# EAGLE design TempHumiditySensorRaspberryPi (EAGLE 8.5.0)
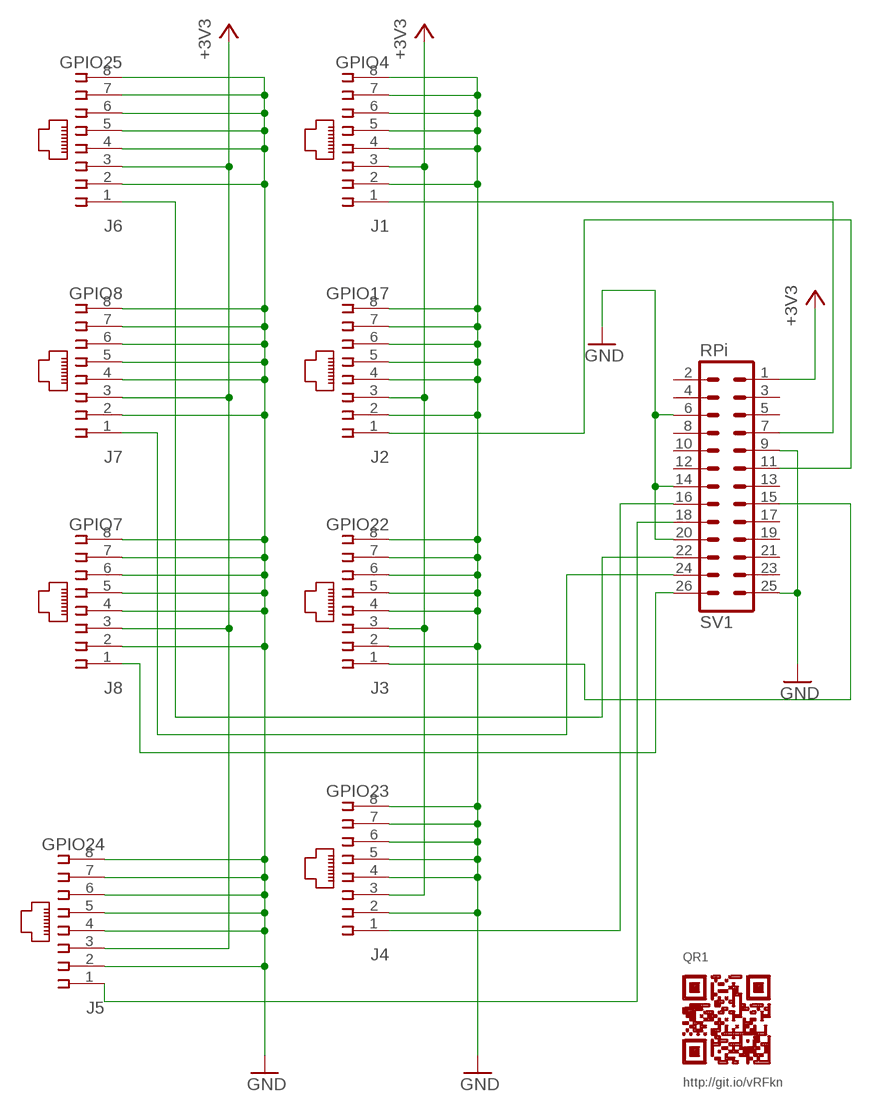
[diagram p0: schematic, sheet 1]

## Parts
J1  GPIO4  555164-1  [555164-1]
J2  GPIO17  555164-1  [555164-1]
J3  GPIO22  555164-1  [555164-1]
J4  GPIO23  555164-1  [555164-1]
J5  GPIO24  555164-1  [555164-1]
J6  GPIO25  555164-1  [555164-1]
J7  GPIO8  555164-1  [555164-1]
J8  GPIO7  555164-1  [555164-1]
QR1  QR-HTTP://GIT.IO/VRFKN  [QR-HTTP://GIT.IO/VRFKN]
SV1  RPi  ML26  [ML26]

## Nets
+3V3 [power]: J1.3 J2.3 J3.3 J4.3 J5.3 J6.3 J7.3 J8.3 SV1.1
GND: J1.2 J1.4 J1.5 J1.6 J1.7 J1.8 J2.2 J2.4 J2.5 J2.6 J2.7 J2.8 J3.2 J3.4 J3.5 J3.6 J3.7 J3.8 J4.2 J4.4 J4.5 J4.6 J4.7 J4.8 J5.2 J5.4 J5.5 J5.6 J5.7 J5.8 J6.2 J6.4 J6.5 J6.6 J6.7 J6.8 J7.2 J7.4 J7.5 J7.6 J7.7 J7.8 J8.2 J8.4 J8.5 J8.6 J8.7 J8.8 SV1.6 SV1.9 SV1.14 SV1.20 SV1.25
N$1: J1.1 SV1.7
N$3: J8.1 SV1.26
N$4: J2.1 SV1.11
N$5: J3.1 SV1.15
N$7: J4.1 SV1.16
N$8: J6.1 SV1.22
N$9: J7.1 SV1.24
N$10: J5.1 SV1.18
Unconnected: SV1.2 SV1.3 SV1.4 SV1.5 SV1.8 SV1.10 SV1.12 SV1.13 SV1.17 SV1.19 SV1.21 SV1.23

## Library data of the parts
J1-J8 = con-amp:555164-1: AMP connector; PARTNO: 5555164-1
QR1 = QR-git.io-vRFkn:QR-HTTP://GIT.IO/VRFKN: QR Code pointing to http://git.io/vRFkn; QR_DEST: http://git.io/vRFkn
SV1 = con-harting-ml:ML26: HARTING; OC_FARNELL: unknown; OC_NEWARK: unknown; PARTNO: SBH11-PBPC-D13-ST-BK

## Net classes
0 default: width 0.508 mm
1 power: width 1.27 mm

## Board
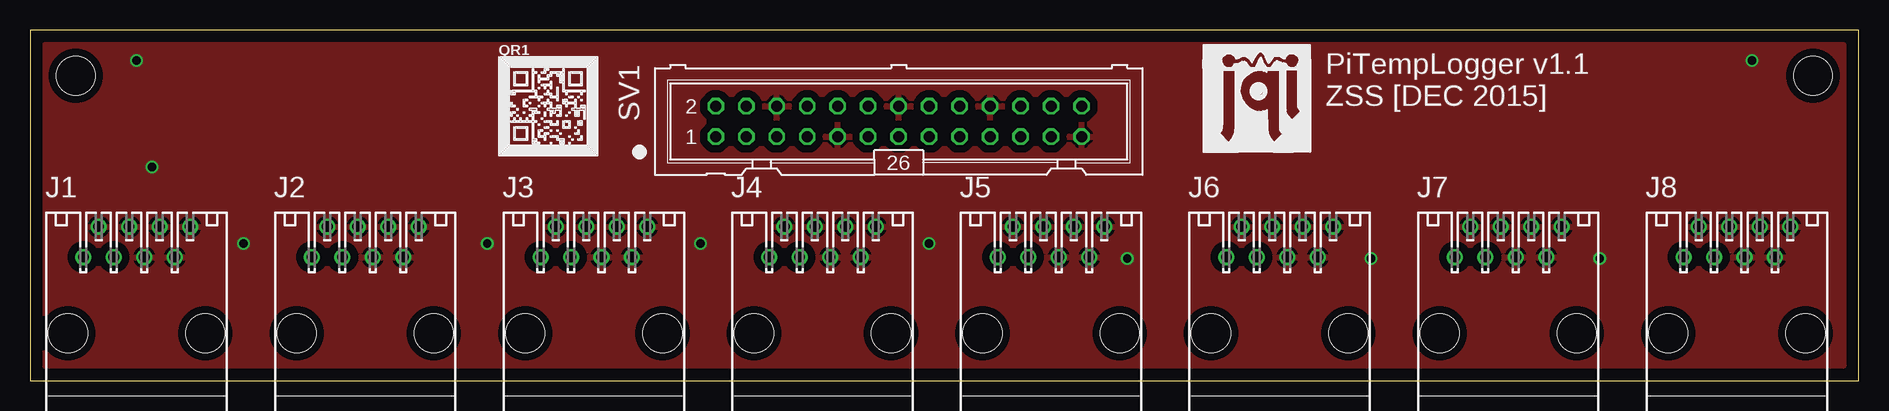
[diagram p1: board, top side]
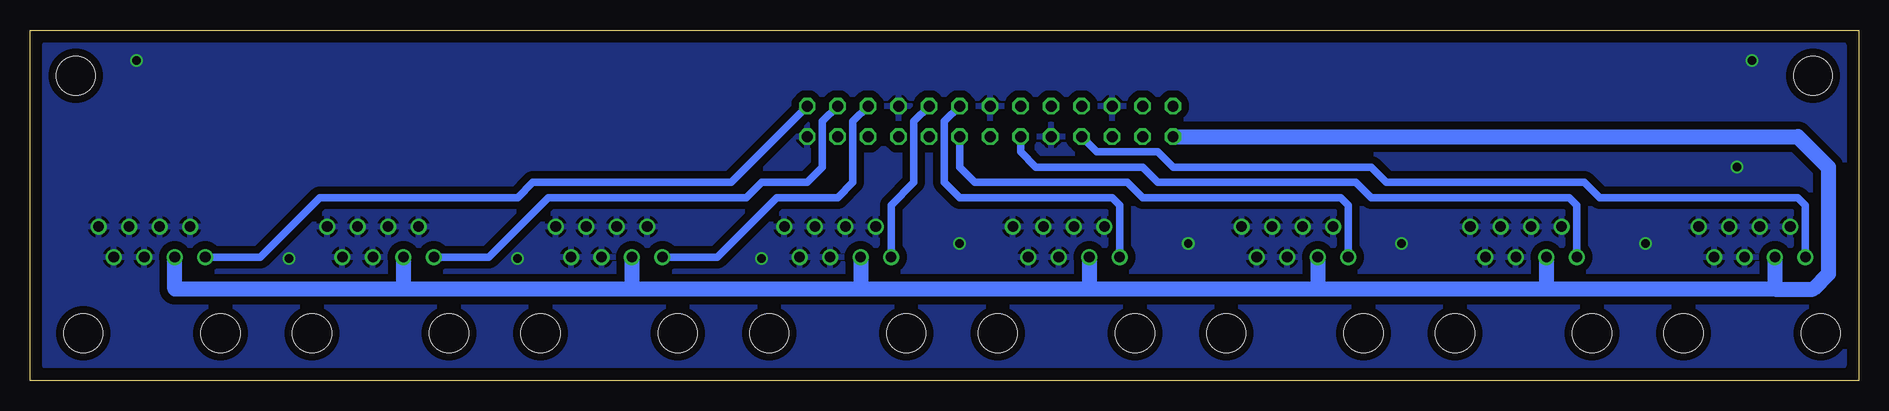
[diagram p2: board, bottom side, seen from below]

Size 152.4 x 29.21 mm. Coordinates in mm from the lower left corner, seen from the top.
Outline: 0,0 152.4,0 152.4,29.21 0,29.21 0,0
Copper layers (1*16): Top 0.035mm / dielectric 1.5mm / Bottom 0.035mm
Design rules "MF_Standard_2_Layer": minimum track width 5mil, minimum drill 12mil, track to track 5mil, track to pad 5mil, pad to pad 5mil, via to via 5mil, smd to smd 0mil, copper to edge 10mil, drill to drill 10mil, minimum pad ring 6mil, minimum via ring 6mil, stop-mask expansion 2mil, vias tented up to drill 25mil, thermal gap 10mil
Holes 3.2 mm at 148.59,25.4 3.81,25.4

### Footprints (pad centres in the part's own frame; a part is rotated, then mirrored left to right if it is on the bottom)
555164-1 = drill 0.889: 1 -4.445,5.207; 2 -3.175,7.747; 3 -1.905,5.207; 4 -0.635,7.747; 5 0.635,5.207; 6 1.905,7.747; 7 3.175,5.207; 8 4.445,7.747 | hole 3.251: -5.715,-1.143; 5.715,-1.143
ML26 = drill 0.914 octagon: 1 -15.24,-1.27; 2 -15.24,1.27; 3 -12.7,-1.27; 4 -12.7,1.27; 5 -10.16,-1.27; 6 -10.16,1.27; 7 -7.62,-1.27; 8 -7.62,1.27; 9 -5.08,-1.27; 10 -5.08,1.27; 11 -2.54,-1.27; 12 -2.54,1.27; 13 0,-1.27; 14 0,1.27; 15 2.54,-1.27; 16 2.54,1.27; 17 5.08,-1.27; 18 5.08,1.27; 19 7.62,-1.27; 20 7.62,1.27; 21 10.16,-1.27; 22 10.16,1.27; 23 12.7,-1.27; 24 12.7,1.27; 25 15.24,-1.27; 26 15.24,1.27

### Placement (x,y rotation side)
J1  8.89,5.08 0 top
J2  27.94,5.08 0 top
J3  46.99,5.08 0 top
J4  66.04,5.08 0 top
J5  85.09,5.08 0 top
J6  104.14,5.08 0 top
J7  123.19,5.08 0 top
J8  142.24,5.08 0 top
LOGO1  JQI-LOGOSILK  [JQI_LOGO_NEGATIVE-SILKSCREEN]  97.79,19.05 0 top
QR1  43.18,22.86 0 top
SV1  72.39,21.59 0 top

### Tracks (layer width: path | path; a pad name or v marks a point on that pad's centre or on a via)
+3V3
  Bottom 1.27: J1.3 6.99,7.62 | 6.99,7.62 3.81,7.62 2.54,8.89 2.54,17.78 5.08,20.32 SV1.1 | 6.99,7.62 26.04,7.62 | 26.04,7.62 45.09,7.62 | 45.09,7.62 64.14,7.62 | 64.14,7.62 83.19,7.62 | 83.19,7.62 102.23,7.62 | 102.23,7.62 121.28,7.62 | 121.28,7.62 140.34,7.62 J8.3 | J7.3 121.28,7.62 | J6.3 102.23,7.62 | J5.3 83.19,7.62 | J4.3 64.14,7.62 | J3.3 45.09,7.62 | J2.3 26.04,7.62
GND  (via drill 0.7)
  other vias: 17.78,11.43 38.1,11.43 55.88,11.43 74.93,11.43 8.89,26.67 143.51,26.67 111.76,10.16 130.81,10.16 10.16,17.78 91.44,10.16
  pour Bottom (isolate 0.635): 1.27,27.94 1.27,1.27 151.13,1.27 151.13,27.94
  pour Bottom (isolate 0.635): 1.27,27.94 1.27,1.27 151.13,1.27 151.13,27.94
  pour Top (isolate 0.635): 1.27,27.94 1.27,1.27 151.13,1.27 151.13,27.94
N$1
  Bottom 0.61: J1.1 4.45,14.61 5.08,15.24 21.59,15.24 22.86,16.51 39.37,16.51 40.64,17.78 57.15,17.78 58.42,19.05 63.5,19.05 SV1.7
N$3
  Bottom 0.61: J8.1 133.22,10.29 128.27,15.24 111.76,15.24 110.49,16.51 93.98,16.51 SV1.26
N$4
  Bottom 0.61: J2.1 23.5,14.61 24.13,15.24 40.64,15.24 41.91,16.51 58.42,16.51 59.69,17.78 68.58,17.78 69.85,19.05 SV1.11
N$5
  Bottom 0.61: J3.1 42.55,14.61 43.18,15.24 59.69,15.24 60.96,16.51 73.66,16.51 74.93,17.78 SV1.15
N$7
  Bottom 0.61: J4.1 61.59,14.61 62.23,15.24 74.93,15.24 76.2,16.51 76.2,21.59 SV1.16
N$8
  Bottom 0.61: J6.1 95.12,10.29 90.17,15.24 85.09,15.24 83.82,16.51 83.82,21.59 SV1.22
N$9
  Bottom 0.61: J7.1 114.17,10.29 109.22,15.24 92.71,15.24 91.44,16.51 87.63,16.51 86.36,17.78 86.36,21.59 SV1.24
N$10
  Bottom 0.61: J5.1 80.64,14.61 78.74,16.51 78.74,21.59 SV1.18

### Text on the board
tNames: PiTempLogger v1.1 / ZSS [DEC 2015]